# EAGLE design jnusb_v21 (EAGLE 5.11)

## Sheet 1 of 2
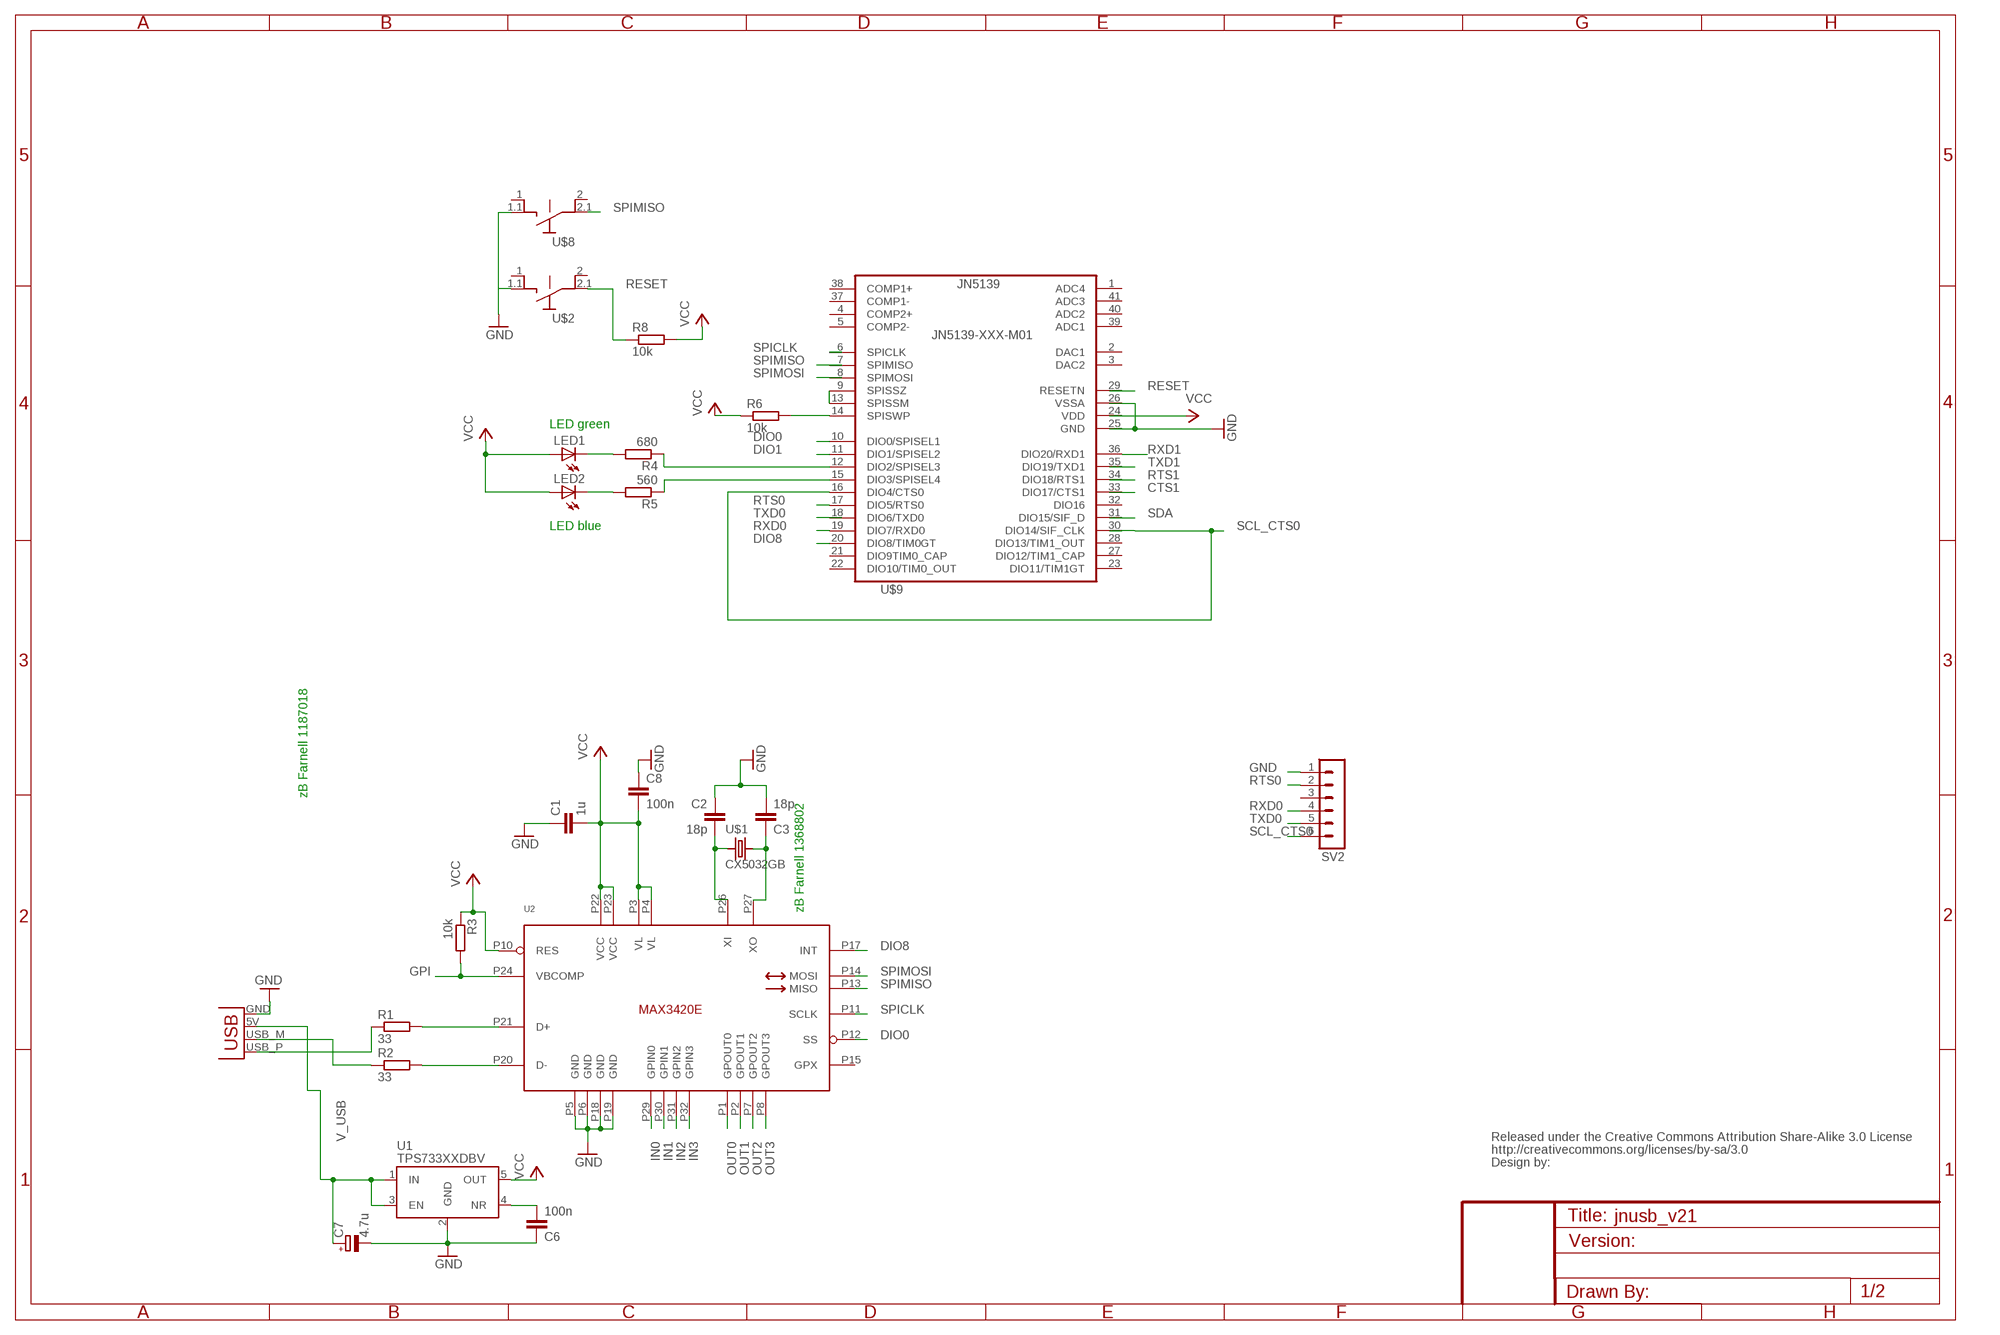
[diagram p0: schematic, sheet 1]

### Parts
C1  1u  C-EUC0603K  [C0603K]
C2  18p  C-EUC0603K  [C0603K]
C3  18p  C-EUC0603K  [C0603K]
C6  100n  C-EUC0603K  [C0603K]
C7  4.7u  CPOL-EU153CLV-0505  [153CLV-0505]
C8  100n  C-EUC0603K  [C0603K]
LED1  LEDCHIP-LED0603  [CHIP-LED0603]
LED2  LEDCHIP-LED0603  [CHIP-LED0603]
R1  33  R-EU_R0603  [R0603]
R2  33  R-EU_R0603  [R0603]
R3  10k  R-EU_R0603  [R0603]
R4  680  R-EU_R0603  [R0603]
R5  560  R-EU_R0603  [R0603]
R6  10k  R-EU_R0603  [R0603]
R8  10k  R-EU_R0603  [R0603]
SV2  MA06-1  [MA06-1]
U1  TPS733XXDBV  [SOT23-5]
U2  MAX3420ELQFP32  [LQFP32]
U$1  CX5032GB  [CX-53F]
U$2  MICRO-SWITCHG  [KMS2XX]
U$5  CREATIVE_COMMONS  [CREATIVE_COMMONS]
U$8  MICRO-SWITCHG  [KMS2XX]
U$9  JN5139-XXX-M01  [JN5139-XXX-MO0]
X1  USBPCB  [USB-A-PCB]

### Nets
CTS1: U$9.33(DIO17/CTS1)
DIO0: U2.P12(SS) U$9.10(DIO0/SPISEL1)
DIO1: U$9.11(DIO1/SPISEL2)
DIO2: R4.1 U$9.12(DIO2/SPISEL3)
DIO3: R5.1 U$9.15(DIO3/SPISEL4)
DIO8: U2.P17(INT) U$9.20(DIO8/TIM0GT)
GND: C1.1 C2.1 C3.2 C6.1 C7.- C8.1 SV2.1 U1.2(GND) U2.P5(GND) U2.P6(GND) U2.P18(GND) U2.P19(GND) U$2.1.1 U$8.1.1 U$9.25(GND) U$9.26(VSSA) X1.GND
GPI: R3.2 U2.P24(VBCOMP)
IN0: U2.P29(GPIN0)
IN1: U2.P30(GPIN1)
IN2: U2.P31(GPIN2)
IN3: U2.P32(GPIN3)
N$1: R1.1 X1.USB_P(D+)
N$2: R2.1 X1.USB_M(D-)
N$3: R1.2 U2.P21(D+)
N$4: R2.2 U2.P20(D-)
N$5: LED1.C R4.2
N$6: C6.2 U1.4(NR)
N$7: LED2.C R5.2
N$8: C2.2 U2.P26(XI) U$1.P$2
N$9: U$9.9(SPISSZ) U$9.13(SPISSM)
N$10: C3.1 U2.P27(XO) U$1.P$1
N$14: R6.2 U$9.14(SPISWP)
OUT0: U2.P1(GPOUT0)
OUT1: U2.P2(GPOUT1)
OUT2: U2.P7(GPOUT2)
OUT3: U2.P8(GPOUT3)
RESET: R8.1 U$2.2.1 U$9.29(RESETN)
RTS0: SV2.2 U$9.17(DIO5/RTS0)
RTS1: U$9.34(DIO18/RTS1)
RXD0: SV2.4 U$9.19(DIO7/RXD0)
RXD1: U$9.36(DIO20/RXD1)
SCL_CTS0: SV2.6 U$9.16(DIO4/CTS0) U$9.30(DIO14/SIF_CLK)
SDA: U$9.31(DIO15/SIF_D)
SPICLK: U2.P11(SCLK) U$9.6(SPICLK)
SPIMISO: U2.P13(MISO) U$8.2.1 U$9.7(SPIMISO)
SPIMOSI: U2.P14(MOSI) U$9.8(SPIMOSI)
TXD0: SV2.5 U$9.18(DIO6/TXD0)
TXD1: U$9.35(DIO19/TXD1)
V_USB: C7.+ U1.1(IN) U1.3(EN) X1.5V(VBUS)
VCC: C1.2 C8.2 LED1.A LED2.A R3.1 R6.1 R8.2 U1.5(OUT) U2.P3(VL) U2.P4(VL) U2.P10(RES) U2.P22(VCC) U2.P23(VCC) U$9.24(VDD)
Unconnected: SV2.3 U2.P15(GPX) U$2.1 U$2.2 U$2.GND U$8.1 U$8.2 U$8.GND U$9.1(ADC4) U$9.2(DAC1) U$9.3(DAC2) U$9.4(COMP2+) U$9.5(COMP2-) U$9.21(DIO9TIM0_CAP) U$9.22(DIO10/TIM0_OUT) U$9.23(DIO11/TIM1GT) U$9.27(DIO12/TIM1_CAP) U$9.28(DIO13/TIM1_OUT) U$9.32(DIO16) U$9.37(COMP1-) U$9.38(COMP1+) U$9.39(ADC1) U$9.40(ADC2) U$9.41(ADC3)

### Notes on the sheet
- LED green
- LED blue
- zB Farnell 1187018
- zB Farnell 1368802

## Sheet 2 of 2

## Library data of the parts
C1-C3 C6 C8 = rcl:C-EU: CAPACITOR, European symbol
C7 = rcl:CPOL-EU: POLARIZED CAPACITOR, European symbol
LED1 LED2 = led:LED: LED OSRAM: - CHIPLED LG R971, LG N971, LY N971, LG Q971, LY Q971, LO R971, LY R971 LH N974, LH R974 LS Q976, LO Q976, LY Q976 LO Q996 - Hyper CHIPLED LW Q18S LB Q993, LB Q99A, LB R99A - SideLED LS A670, LO A670, LY A670, LG A670, LP A670 LB A673, LV A673, LT A673, LW A673 LH A674 LY A675 LS A676, LA A676, LO A676, LY A676, LW A676 LS A679, LY A679, LG A679 - Hyper Micro SIDELED® LS Y876, LA Y876, LO Y876, LY Y876 LT Y87S - SmartLED LW L88C, LW L88S LB L89C, LB L89S, LG L890 LS L89K, LO L89K, LY L89K LS L896, LA L896, LO L896, LY L896 - TOPLED LS T670, LO T670, LY T670, LG T670, LP T670 LSG T670, LSP T670, LSY T670, LOP T670, LYG T670 LG T671, LOG T671, LSG T671 LB T673, LV T673, LT T673, LW T673 LH T674 LS T676, LA T676, LO T676, LY T676, LB T676, LH T676, LSB T676, LW T676 LB T67C, LV T67C, LT T67C, LS T67K, LO T67K, LY T67K, LW E67C LS E67B, LA E67B, LO E67B, LY E67B, LB E67C, LV E67C, LT E67C LW T67C LS T679, LY T679, LG T679 LS T770, LO T770, LY T770, LG T770, LP T770 LB T773, LV T773, LT T773, LW T773 LH T774 LS E675, LA E675, LY E675, LS T675 LS T776, LA T776, LO T776, LY T776, LB T776 LHGB T686 LT T68C, LB T68C - Hyper Mini TOPLED® LB M676 - Mini TOPLED Santana® LG M470 LS M47K, LO M47K, LY M47K Source: http://www.osram.convergy.de/
R1-R6 R8 = rcl:R-EU_: RESISTOR, European symbol
SV2 = con-lstb:MA06-1: PIN HEADER
U1 = teco_ics:TPS733XX: ULTRALOW-NOISE, HIGH PSRR, FAST RF 200-mA LOW-DROPOUT LINEAR REGULATORS IN NANOSTAR WAFER CHIP SCALE AND SOT23 Farnell: 1207346
U2 = teco_ics:MAX3420E: MAXIM - MAX3420EECJ+ USB P/H CONTROLLER, SPI, 32LQFP Farnell Best.Nr.:1593354 USB P/H CONTROLLER, SPI, 32LQFP Treiber, IC-Typ:Controller Ausgänge, Zahl der:4 Spannung, Ausgang:4.3V Spannung, Versorgung min.:3V Gehäusetyp:LQFP Temperatur Arbeitsbereich:-40°C to +85°C Anschlussart:SMD Frequenz:26MHz Kanäle, Zahl der:4 Pin, Zahl der:32 Spannung, Versorgung max.:3.6V Temperatur, Betriebs- max.:85°C Temperatur, Betriebs- min.:-40°C
U$1 = teco_div:CX5032GB: Crystal CX-53F (CX5032GB) AVX - CX5032GB12000H0PESZZ - QUARZ, SM, CX-53F Farnell: 1368769 5 x 3.2mm SMD
U$2 U$8 = teco_switches:MICRO-SWITCH
U$5 = SparkFun:CREATIVE_COMMONS
U$9 = jennic:JN5139-XXX-M01: JN5139-xxx-M00xxx, Farnell: 1500175
X1 = SparkFun:USB: USB Connectors USB-B-PTH is fully proven SKU : PRT-00139 USB-miniB is fully proven SKU : PRT-00587 USB-A-PCB is untested. USB-A-H is throughly reviewed, but untested. Spark Fun Electronics SKU : PRT-00437 USB-B-SMT is throughly reviewed, but untested. Needs silkscreen touching up. USB-A-S has not been used/tested USB-MB-H has not been used/tested

## Board
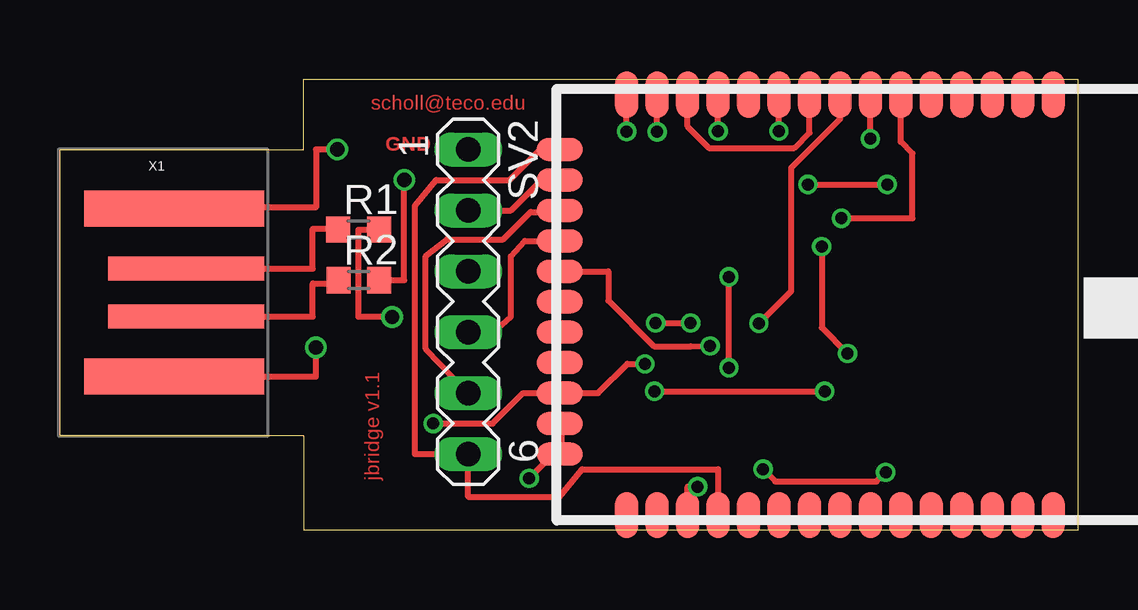
[diagram p1: board, top side]
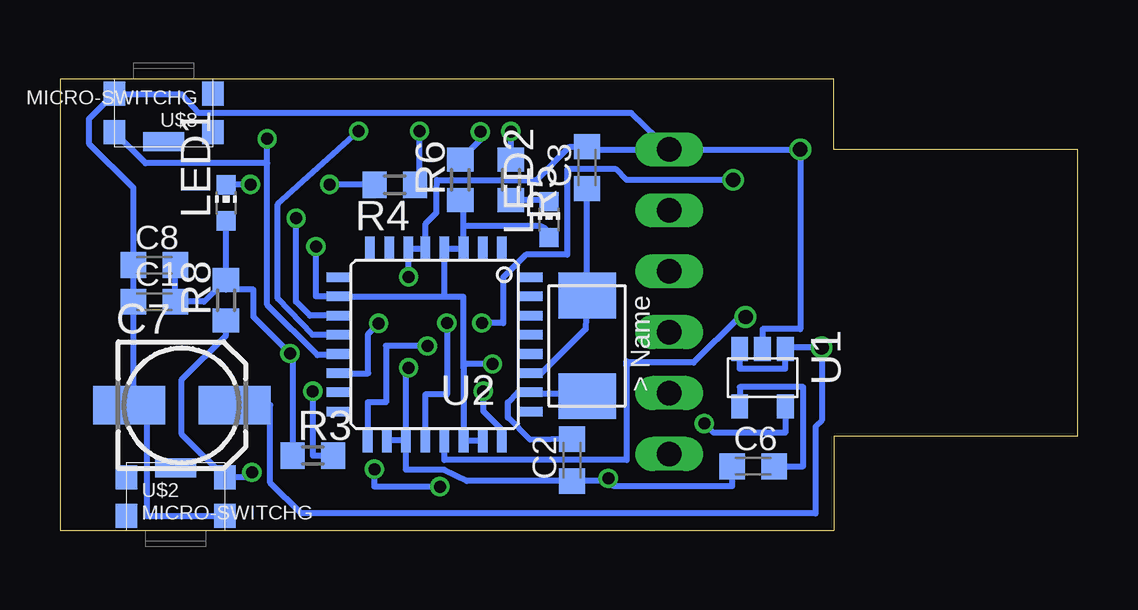
[diagram p2: board, bottom side, seen from below]

Size 42.42 x 18.8 mm. Coordinates in mm from the lower left corner, seen from the top.
Outline: 10.16,18.8 42.42,18.8 42.42,0 10.16,0 10.16,3.94 0,3.94 0,15.88 10.16,15.88 10.16,18.8
Copper layers (1*16): Top 0.035mm / dielectric 1.5mm / Bottom 0.035mm
Design rules "PCB-POOL": minimum track width 6mil, minimum drill 12mil, track to track 6mil, track to pad 6mil, pad to pad 6mil, via to via 6mil, smd to smd 6mil, copper to edge 20mil, drill to drill 8mil, minimum pad ring 8mil, minimum via ring 6mil, stop-mask expansion 3mil, vias tented up to drill 0mil, thermal gap 8mil

### Footprints (pad centres in the part's own frame; a part is rotated, then mirrored left to right if it is on the bottom)
C0603K = smd 1.05 x 1.08: 1 -0.875,0; 2 0.875,0
153CLV-0505 = smd 3 x 1.6: + 2.2,0; - -2.2,0
CHIP-LED0603 = smd 0.8 x 0.8: A 0,-0.75; C 0,0.75
R0603 = smd 1 x 1.1: 1 -0.85,0; 2 0.85,0
MA06-1 = drill 1.016 long: 1 -6.35,0; 2 -3.81,0; 3 -1.27,0; 4 1.27,0; 5 3.81,0; 6 6.35,0
SOT23-5 = smd 1 x 0.7: 1 -1.2,0.95; 2 -1.2,0; 3 -1.2,-0.95; 4 1.2,-0.95; 5 1.2,0.95
LQFP32 = smd 0.4 x 1: P1 -2.8,-4; P2 -2,-4; P3 -1.2,-4; P4 -0.4,-4; P5 0.4,-4; P6 1.1,-4; P7 1.9,-4; P8 2.7,-4; P17 2.8,4; P18 2,4; P19 1.2,4; P20 0.4,4; P21 -0.4,4; P22 -1.2,4; P23 -2,4; P24 -2.8,4 | smd 1 x 0.4: P9 4,-2.8; P10 4,-2; P11 4,-1.2; P12 4,-0.4; P13 4,0.4; P14 4,1.2; P15 4,2; P16 4,2.8; P25 -4,2.8; P26 -4,2; P27 -4,1.2; P28 -4,0.4; P29 -4,-0.4; P30 -4,-1.2; P31 -4,-2; P32 -4,-2.8
CX-53F = smd 1.9 x 2.4: P$1 -2.1,0; P$2 2.1,0
KMS2XX = smd 0.9 x 1: 1 -2.05,-0.8; 1.1 2.05,-0.8; 2 -2.05,0.8; 2.1 2.05,0.8 | smd 1.7 x 0.8: GND 0,1.2
JN5139-XXX-MO0 = smd 1.93 x 0.965: 1 0,0; 2 0,-1.27; 3 0,-2.54; 4 0,-3.81; 5 0,-5.08; 6 0,-6.35; 7 0,-7.62; 8 0,-8.89; 9 0,-10.16; 10 0,-11.43; 11 0,-12.7; 12 0,-13.97; 13 0,-15.24; 14 0,-16.51; 15 0,-17.78; 27 17.526,-17.78; 28 17.526,-16.51; 29 17.526,-15.24; 30 17.526,-13.97; 31 17.526,-12.7; 32 17.526,-11.43; 33 17.526,-10.16; 34 17.526,-8.89; 35 17.526,-7.62; 36 17.526,-6.35; 37 17.526,-5.08; 38 17.526,-3.81; 39 17.526,-2.54; 40 17.526,-1.27; 41 17.526,0 | smd 0.965 x 1.93: 16 2.286,-20.574; 17 3.556,-20.574; 18 4.826,-20.574; 19 6.096,-20.574; 20 7.366,-20.574; 21 8.636,-20.574; 22 9.906,-20.574; 23 11.176,-20.574; 24 12.446,-20.574; 25 13.716,-20.574; 26 14.986,-20.574
USB-A-PCB = smd 7.5 x 1.5: 5V -0.2,-3.5; GND -0.2,3.5 | smd 6.5 x 1: USB_M 0.3,-1; USB_P 0.3,1

### Placement (x,y rotation side)
C1  38.48,9.52 0 bottom
C2  21.07,2.92 90 bottom
C3  20.45,15.11 90 bottom
C6  13.53,2.67 0 bottom
C7  37.34,5.21 0 bottom
C8  38.48,11.05 0 bottom
LED1  35.5,13.65 0 bottom
LED2  22.03,12.95 0 bottom
R1  12.45,12.53 0 top
R2  12.46,10.43 0 top
R3  31.88,3.11 0 bottom
R4  28.46,14.4 180 bottom
R5  23.62,14.61 270 bottom
R6  25.73,14.61 90 bottom
R8  35.5,9.59 90 bottom
SV2  17.02,9.52 270 top
U1  13.13,6.35 270 bottom
U2  26.8,7.75 180 bottom
U$1  20.45,7.68 270 bottom
U$2  37.59,1.4 0 bottom
U$5  21.21,-17.65 0 top  (outside the outline)
U$8  38.1,17.4 180 bottom
U$9  41.4,18.16 270 top
X1  4.95,9.91 0 top

### Tracks (layer width: path | path; a pad name or v marks a point on that pad's centre or on a via)
DIO0  (via drill 0.5)
  Top 0.254: v29.97,16.64 U$9.10
  Bottom 0.254: v29.97,16.64 33.34,13.59 33.34,9.65 31.9,8.15 U2.P12
DIO2  (via drill 0.5)
  Top 0.254: v27.43,16.64 U$9.12
  Bottom 0.254: v27.43,16.64 27.43,14.58 R4.1
DIO3  (via drill 0.5)
  Top 0.254: v23.62,16.62 U$9.15
  Bottom 0.254: R5.1 v23.62,16.62
DIO8  (via drill 0.5)
  Top 0.254: U$9.20 22.86,10.8 22.86,9.58 24.77,7.67 26.3,7.67 v27.1,7.68
  Bottom 0.254: U2.P17 29.59,5.33 28.83,5.33 28.83,7.68 v27.1,7.68
GND  (via drill 0.5, 0.6)
  Top 0.254: v27.89,6.77 v27.89,10.57 | U$9.26 20.57,3.17 v19.56,2.16 | X1.GND 6.28,13.46 10.67,13.46 10.67,15.88 v11.56,15.88
  Top 0.457: U$9.26 U$9.25
  Bottom 0.254: SV2.1 20.33,15.88 C3.2 21.17,15.99 22.55,14.61 26.71,14.61 26.72,14.15 26.72,13.23 27.18,12.78 27.18,11.77 U2.P5 U2.P6 v27.89,10.57 | 40.69,5.11 40.74,5.16 39.59,5.16 C7.- | C7.- 39.36,5.21 C1.1 C8.1 39.36,14.27 39.37,14.29 | 41.21,17.14 41.21,16.13 39.37,14.29 | 41.21,17.14 U$8.1.1 | U2.P19 U2.P18 | C7.- 38.8,5.21 38.8,4.64 | v19.56,2.16 19.57,2.17 | U$2.1.1 38.8,0.6 38.8,4.64 | 38.8,4.64 39.37,4.64 39.37,14.29 | 41.21,17.14 40.2,18.16 37.34,18.16 36.64,17.4 18.61,17.4 SV2.1 | U2.P19 28,2.52 26.4,2.52 25.45,2.05 C2.1 19.67,2.05 arc-90 v19.56,2.16 | v19.56,2.16 arc-90 19.23,1.83 14.4,1.83 C6.1 | U2.P19 28,6.66 arc90 v27.89,6.77 | U1.2 13.13,8.38 11.56,8.38 v11.56,15.88 SV2.1
GPI  (via drill 0.5)
  Top 0.254: v24.78,5.79 v31.88,5.79
  Bottom 0.254: v31.88,5.79 31.88,3.11 R3.2 | U2.P24 24,4.19 24.77,4.95 24.77,5.78 v24.78,5.79
N$1
  Top 0.254: X1.USB_P 10.54,10.91 10.54,12.57 11.6,12.57 R1.1
N$2
  Top 0.254: R2.1 11.61,10.29 10.54,10.29 10.54,8.91 X1.USB_M
N$3  (via drill 0.6)
  Top 0.254: R1.2 12.45,12.54 12.45,8.89 v13.84,8.89
  Bottom 0.254: U2.P21 26.4,2.92 18.8,2.92 18.8,6.86 | 18.8,6.86 18.8,7.05 | v13.84,8.89 14.1,8.89 16,6.99 18.67,6.99 18.8,6.86
N$4  (via drill 0.5, 0.6)
  Top 0.254: v24.83,8.64 v26.29,8.64 | v14.35,14.61 14.35,10.43 R2.2
  Bottom 0.254: U2.P20 27.2,5.65 26.29,5.65 v26.29,8.64 | v24.83,8.64 23.94,8.64 23.94,10.54 22.99,11.49 21.27,11.49 21.27,15.05 19.24,15.05 18.8,14.61 v14.35,14.61
N$5  (via drill 0.5)
  Top 0.254: v31.18,14.41 v34.48,14.41
  Bottom 0.254: R4.2 29.32,14.41 v31.18,14.41 | v34.48,14.41 34.49,14.4 LED1.C
N$6
  Bottom 0.254: U1.4 14.08,5.97 11.43,5.97 11.43,2.67 C6.2
N$7
  Bottom 0.254: LED2.C arc-90 22.09,13.75 R5.2
N$8
  Bottom 0.254: U$1.P$2 20.45,5.71 22.76,5.71 U2.P26 23.34,5.75 23.75,5.33 23.75,4.7 22.82,3.77 C2.2
N$9
  Top 0.254: U$9.13 26.16,16.83 27.05,15.94 30.61,15.94 31.24,16.57 U$9.9
N$10
  Bottom 0.254: C3.1 20.45,9.97 arc90 U$1.P$1 20.51,8.38 22.35,6.55 U2.P27
N$14  (via drill 0.5)
  Top 0.254: v24.89,16.61 U$9.14
  Bottom 0.254: v24.89,16.61 24.89,16.29 R6.2
RESET  (via drill 0.5)
  Top 0.254: v34.42,2.41 34.04,2.03 29.82,2.03 v29.31,2.54 | U$9.29 26.16,1.82 v26.58,1.82
  Bottom 0.254: R8.1 35.5,8.13 37.34,6.29 37.34,3.99 U$2.2.1 34.63,2.2 v34.42,2.41 | v26.58,1.82 29.31,1.82 v29.31,2.54
RTS0
  Top 0.254: 20.07,14.61 18.8,13.34 SV2.2
  Top 0.406: 20.07,14.61 U$9.17
RXD0
  Top 0.254: SV2.4 18.1,8.25 18.8,8.89 18.8,11.43 19.37,12.07 U$9.19
SCL_CTS0
  Top 0.254: 27.5,0.64 U$9.30 27.43,2.54 21.77,2.54 20.83,1.4 17.02,1.4 SV2.6 14.8,3.17 14.8,13.53 15.68,14.61 18.73,14.61 20,15.88 U$9.16
SPICLK  (via drill 0.5)
  Top 0.254: U$9.6 35.05,16.19 35.53,15.71 35.53,13 v32.58,13
  Bottom 0.254: U2.P11 32,8.95 32.58,9.52 v32.58,13
SPIMISO  (via drill 0.5)
  Top 0.254: v33.78,16.32 U$9.7
  Bottom 0.254: U2.P13 30.84,7.3 31.69,7.3 33.78,9.4 33.78,15.3 | 33.78,15.3 v33.78,16.32 | U$8.2.1 38.85,15.3 33.78,15.3
SPIMOSI  (via drill 0.5)
  Top 0.254: U$9.8 32.51,17.14 30.48,15.11 30.48,9.97 v29.13,8.62
  Bottom 0.254: U2.P14 29.57,6.54 29.57,8.19 v29.13,8.62
TXD0
  Top 0.254: SV2.5 15.24,7.56 15.24,11.43 16.13,12.13 18.48,12.13 19.62,13.27 20.77,13.27 U$9.18
V_USB  (via drill 0.6)
  Top 0.254: v10.67,7.62 10.67,6.41 X1.5V
  Bottom 0.254: C7.+ 33.65,5.21 33.65,1.98 32.37,0.7 10.92,0.7 10.92,4.32 10.67,4.57 v10.67,7.62 12.18,7.62 | U1.3 14.08,6.73 12.19,6.73 U1.1
  Bottom 0.406: 12.18,7.62 U1.1
VCC  (via drill 0.5)
  Top 0.254: v32.83,7.37 31.75,8.45 v31.75,11.82 | v15.56,4.45 18.03,4.45 19.3,5.71 U$9.24 22.43,5.71 23.65,6.93 v24.38,6.93
  Bottom 0.254: U2.P3 U2.P4 26.4,9.73 | U2.P3 25.6,13.62 R6.1 | C8.2 C1.2 36.41,9.52 R8.2 | U2.P3 25.6,12.7 22.53,12.7 arc90 LED2.A | R8.2 LED1.A | R8.2 35.5,10.03 34.35,10.03 34.35,8.89 v32.83,7.37 32.73,7.26 R3.1 | 26.4,9.73 30.78,9.73 U2.P10 31.75,9.75 v31.75,11.82 | 26.4,9.73 25.6,9.73 25.6,6.78 | U2.P23 U2.P22 25.6,6.78 | v24.38,6.93 25.45,6.93 arc-90 25.6,6.78 | U1.5 12.18,4.06 15.18,4.06 v15.56,4.45

### Text on the board
Top: scholl@teco.edu | GND | jbridge v1.1